# EAGLE schematic Automatic Pet Feeder (EAGLE 9.6.2)

## Sheet 1 of 3
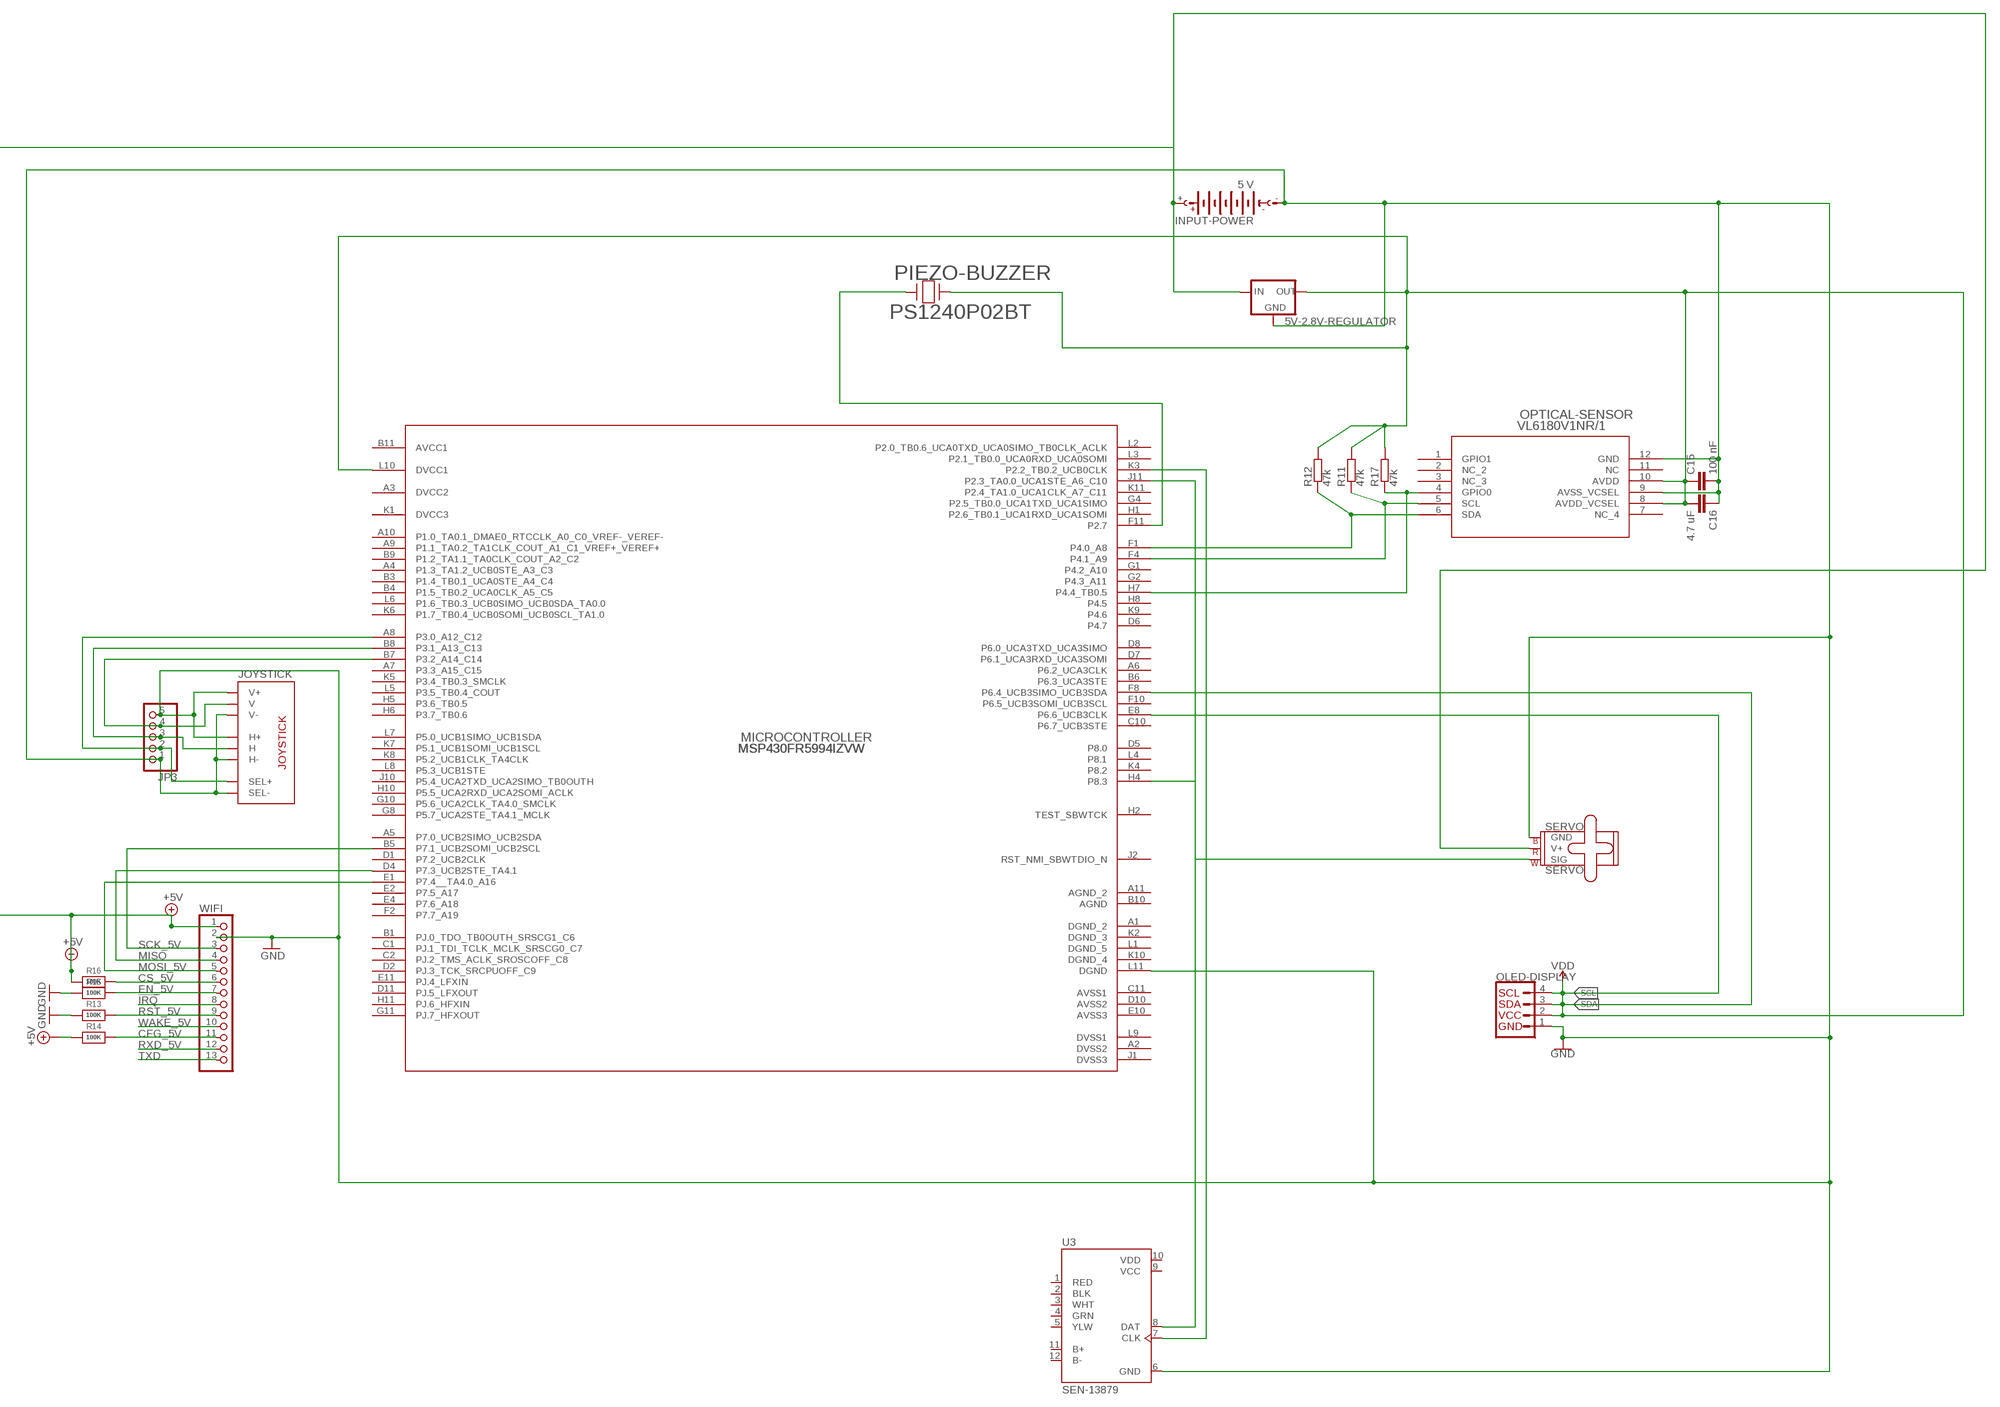
[diagram p0: schematic, sheet 1]

### Parts
5V-2.8V-REGULATOR  78XXS  [78XXS]
C15  100 nF  C2.5/2  [C2.5-2]
C16  4.7 uF  C2.5/2  [C2.5-2]
INPUT-POWER  5 V  AB9V  [AB9V]
JOYSTICK  JOYSTICKPTH  [JOYSTICK]
JP3  PINHD-1X5  [1X05]
MICROCONTROLLER  MSP430FR5994IZVW  [ZVW0087A]
OLED-DISPLAY  I2C_STANDARD_NO_SILK  [1X04_NO_SILK]
OPTICAL-SENSOR  VL6180V1NR/1  [VL6180X_STM]
PIEZO-BUZZER  PS1240P02BT  [XTAL_PS1240P02BT_TDK]
R11  47k  PMD  [PMD]
R12  47k  PMD  [PMD]
R13  100K  RESISTOR0805_NOOUTLINE  [0805-NO]
R14  100K  RESISTOR0805_NOOUTLINE  [0805-NO]
R15  100K  RESISTOR_0805MP  [_0805MP]
R16  100K  RESISTOR_0805MP  [_0805MP]
R17  47k  PMD  [PMD]
SERVO  SERVO  [1X03]
U3  SEN-13879  [SPARKFUN_SEN-13879]
WIFI  HEADER-1X13  [1X13_ROUND_70]

### Nets
!IRQ: WIFI.8
+5V: 5V-2.8V-REGULATOR.IN INPUT-POWER.+ R14.1 R16.1 WIFI.1
CFG_5V: R14.2 WIFI.11
CS_5V: R16.2 WIFI.6
EN_5V: R15.2 WIFI.7
GND: 5V-2.8V-REGULATOR.GND C15.2 C16.1 INPUT-POWER.- JOYSTICK.B2A(SEL-) JOYSTICK.H1(H+) JOYSTICK.H3(H-) JOYSTICK.V1(V+) JOYSTICK.V3(V-) JP3.1 JP3.5 MICROCONTROLLER.L11(DGND) OLED-DISPLAY.1(GND) OPTICAL-SENSOR.9(AVSS_VCSEL) OPTICAL-SENSOR.12(GND) R13.1 R15.1 SERVO.3(GND) U3.6(GND) WIFI.2
MISO: MICROCONTROLLER.D4(P7.3_UCB2STE_TA4.1) WIFI.4
MOSI_5V: MICROCONTROLLER.E1(P7.4__TA4.0_A16) WIFI.5
N$13: MICROCONTROLLER.H4(P8.3) SERVO.1(SIG)
N$14: MICROCONTROLLER.K3(P2.2_TB0.2_UCB0CLK) U3.7(CLK)
N$15: JOYSTICK.V2(V) JP3.4 MICROCONTROLLER.B7(P3.2_A14_C14)
N$16: JOYSTICK.H2(H) JP3.3 MICROCONTROLLER.B8(P3.1_A13_C13)
N$17: JOYSTICK.B1A(SEL+) JP3.2 MICROCONTROLLER.A8(P3.0_A12_C12)
N$18: MICROCONTROLLER.F11(P2.7) PIEZO-BUZZER.1
N$19: MICROCONTROLLER.J11(P2.3_TA0.0_UCA1STE_A6_C10) U3.8(DAT)
N$26: MICROCONTROLLER.H7(P4.4_TB0.5) OPTICAL-SENSOR.4(GPIO0) R17.2
N$27: MICROCONTROLLER.F4(P4.1_A9) OPTICAL-SENSOR.5(SCL) R11.2
N$28: MICROCONTROLLER.F1(P4.0_A8) OPTICAL-SENSOR.6(SDA) R12.2
N$29: SERVO.2(V+)
RST_5V: R13.2 WIFI.9
RXD_5V: WIFI.12
SCK_5V: MICROCONTROLLER.B5(P7.1_UCB2SOMI_UCB2SCL) WIFI.3
SCL: OLED-DISPLAY.4(SCL)
SDA: OLED-DISPLAY.3(SDA)
TXD: WIFI.13
VDD: 5V-2.8V-REGULATOR.OUT C15.1 C16.2 MICROCONTROLLER.E8(P6.6_UCB3CLK) MICROCONTROLLER.F8(P6.4_UCB3SIMO_UCB3SDA) MICROCONTROLLER.L10(DVCC1) OLED-DISPLAY.2(VCC) OPTICAL-SENSOR.8(AVDD_VCSEL) OPTICAL-SENSOR.10(AVDD) PIEZO-BUZZER.2 R11.1 R12.1 R17.1
WAKE_5V: WIFI.10
Unconnected: MICROCONTROLLER.A4(P1.3_TA1.2_UCB0STE_A3_C3) MICROCONTROLLER.A5(P7.0_UCB2SIMO_UCB2SDA) MICROCONTROLLER.A6(P6.2_UCA3CLK) MICROCONTROLLER.A7(P3.3_A15_C15) MICROCONTROLLER.A9(P1.1_TA0.2_TA1CLK_COUT_A1_C1_VREF+_VEREF+) MICROCONTROLLER.A10(P1.0_TA0.1_DMAE0_RTCCLK_A0_C0_VREF-_VEREF-) MICROCONTROLLER.B1(PJ.0_TDO_TB0OUTH_SRSCG1_C6) MICROCONTROLLER.B3(P1.4_TB0.1_UCA0STE_A4_C4) MICROCONTROLLER.B4(P1.5_TB0.2_UCA0CLK_A5_C5) MICROCONTROLLER.B6(P6.3_UCA3STE) MICROCONTROLLER.B9(P1.2_TA1.1_TA0CLK_COUT_A2_C2) MICROCONTROLLER.C1(PJ.1_TDI_TCLK_MCLK_SRSCG0_C7) MICROCONTROLLER.C2(PJ.2_TMS_ACLK_SROSCOFF_C8) MICROCONTROLLER.C10(P6.7_UCB3STE) MICROCONTROLLER.D1(P7.2_UCB2CLK) MICROCONTROLLER.D2(PJ.3_TCK_SRCPUOFF_C9) MICROCONTROLLER.D5(P8.0) MICROCONTROLLER.D6(P4.7) MICROCONTROLLER.D7(P6.1_UCA3RXD_UCA3SOMI) MICROCONTROLLER.D8(P6.0_UCA3TXD_UCA3SIMO) MICROCONTROLLER.D11(PJ.5_LFXOUT) MICROCONTROLLER.E2(P7.5_A17) MICROCONTROLLER.E4(P7.6_A18) MICROCONTROLLER.E11(PJ.4_LFXIN) MICROCONTROLLER.F2(P7.7_A19) MICROCONTROLLER.F10(P6.5_UCB3SOMI_UCB3SCL) MICROCONTROLLER.G1(P4.2_A10) MICROCONTROLLER.G2(P4.3_A11) MICROCONTROLLER.G4(P2.5_TB0.0_UCA1TXD_UCA1SIMO) MICROCONTROLLER.G8(P5.7_UCA2STE_TA4.1_MCLK) MICROCONTROLLER.G10(P5.6_UCA2CLK_TA4.0_SMCLK) MICROCONTROLLER.G11(PJ.7_HFXOUT) MICROCONTROLLER.H1(P2.6_TB0.1_UCA1RXD_UCA1SOMI) MICROCONTROLLER.H2(TEST_SBWTCK) MICROCONTROLLER.H5(P3.6_TB0.5) MICROCONTROLLER.H6(P3.7_TB0.6) MICROCONTROLLER.H8(P4.5) MICROCONTROLLER.H10(P5.5_UCA2RXD_UCA2SOMI_ACLK) MICROCONTROLLER.H11(PJ.6_HFXIN) MICROCONTROLLER.J2(RST_NMI_SBWTDIO_N) MICROCONTROLLER.J10(P5.4_UCA2TXD_UCA2SIMO_TB0OUTH) MICROCONTROLLER.K4(P8.2) MICROCONTROLLER.K5(P3.4_TB0.3_SMCLK) MICROCONTROLLER.K6(P1.7_TB0.4_UCB0SOMI_UCB0SCL_TA1.0) MICROCONTROLLER.K7(P5.1_UCB1SOMI_UCB1SCL) MICROCONTROLLER.K8(P5.2_UCB1CLK_TA4CLK) MICROCONTROLLER.K9(P4.6) MICROCONTROLLER.K11(P2.4_TA1.0_UCA1CLK_A7_C11) MICROCONTROLLER.L2(P2.0_TB0.6_UCA0TXD_UCA0SIMO_TB0CLK_ACLK) MICROCONTROLLER.L3(P2.1_TB0.0_UCA0RXD_UCA0SOMI) MICROCONTROLLER.L4(P8.1) MICROCONTROLLER.L5(P3.5_TB0.4_COUT) MICROCONTROLLER.L6(P1.6_TB0.3_UCB0SIMO_UCB0SDA_TA0.0) MICROCONTROLLER.L7(P5.0_UCB1SIMO_UCB1SDA) MICROCONTROLLER.L8(P5.3_UCB1STE) OPTICAL-SENSOR.1(GPIO1) OPTICAL-SENSOR.2(NC_2) OPTICAL-SENSOR.3(NC_3) OPTICAL-SENSOR.7(NC_4) OPTICAL-SENSOR.11(NC) U3.1(RED) U3.2(BLK) U3.3(WHT) U3.4(GRN) U3.5(YLW) U3.11(B+) U3.12(B-)

## Sheet 2 of 3

## Sheet 3 of 3

## Power pins joined to a net without a drawn wire
AGND: MICROCONTROLLER.B10(AGND)
AGND_2: MICROCONTROLLER.A11(AGND_2)
AVCC1: MICROCONTROLLER.B11(AVCC1)
AVSS1: MICROCONTROLLER.C11(AVSS1)
AVSS2: MICROCONTROLLER.D10(AVSS2)
AVSS3: MICROCONTROLLER.E10(AVSS3)
DGND_2: MICROCONTROLLER.A1(DGND_2)
DGND_3: MICROCONTROLLER.K2(DGND_3)
DGND_4: MICROCONTROLLER.K10(DGND_4)
DGND_5: MICROCONTROLLER.L1(DGND_5)
DVCC2: MICROCONTROLLER.A3(DVCC2)
DVCC3: MICROCONTROLLER.K1(DVCC3)
DVSS1: MICROCONTROLLER.L9(DVSS1)
DVSS2: MICROCONTROLLER.A2(DVSS2)
DVSS3: MICROCONTROLLER.J1(DVSS3)
VCC: U3.9(VCC)
VDD: U3.10(VDD)

## Library data of the parts
5V-2.8V-REGULATOR = v-reg:78XXS: VOLTAGE REGULATOR
C15 C16 = capacitor-wima:C: CAPACITOR naming: grid - package width
INPUT-POWER = battery:AB9V: 9-V BATTERY CLIP
JOYSTICK = adafruit:JOYSTICK: Thumb Joystick Joystick commonly found in PS2 controllers. Two pots and a select switch. Adapted from Sparkfun Library (but for more common 6mm switch sticks)
JP3 = pinhead:PINHD-1X5: PIN HEADER
MICROCONTROLLER = library:MSP430FR5994IZVW; COPYRIGHT: Copyright (C) 2025 Ultra Librarian. All rights reserved.; MANUFACTURER_PART_NUMBER: MSP430FR5994IZVW; MFR_NAME: Texas Instruments; REFDES: RefDes; TYPE: TYPE
OLED-DISPLAY = SparkX:I2C_STANDARD: SparkFun I2C Standard Pinout Header SparkFun has standardized on a pinout for all I2C based sensor breakouts. This pinout allows I2C boards to be plugged directly into the headers on Arduino Uno compatible boards, and to be daisy chained easily. Example SparkFun Products: SparkFun Atmospheric Sensor Breakout - BME280 <https://www.sparkfun.com/products/13676> SparkFun Altitude/Pressure Sensor Breakout - MPL3115A2 <https://www.sparkfun.com/products/11084> SparkFun TOF Range Finder Sensor - VL6180 <https://www.sparkfun.com/products/12785>
OPTICAL-SENSOR = library:VL6180V1NR/1; COPYRIGHT: Copyright (C) 2025 Ultra Librarian. All rights reserved.; MANUFACTURER_PART_NUMBER: VL6180V1NR/1; MFR_NAME: STMicroelectronics
PIEZO-BUZZER = library:PS1240P02BT; COPYRIGHT: Copyright (C) 2025 Ultra Librarian. All rights reserved.; MANUFACTURER_PART_NUMBER: PS1240P02BT; MFR_NAME: TDK
R11 R12 R17 = resistor-shunt:PMD: SMD SHUNT RESISTOR; OC_FARNELL: unknown; OC_NEWARK: unknown
R13-R16 = microbuilder:RESISTOR: Resistors For new designs, use the packages preceded by an '_' character since they are more reliable: The following footprints should be used on most boards: _0402 - Standard footprint for regular board layouts _0603 - Standard footprint for regular board layouts _0805 - Standard footprint for regular board layouts _1206 - Standard footprint for regular board layouts For extremely tight-pitch boards where space is at a premium, the following 'micro-pitch' footprints can be used (smaller pads, no silkscreen outline, etc.): _0402MP - Micro-pitch footprint for very dense/compact boards _0603MP - Micro-pitch footprint for very dense/compact boards _0805MP - Micro-pitch footprint for very dense/compact boards _1206MP - Micro-pitch footprint for very dense/compact boards
SERVO = SparkFun-Electromechanical:SERVO: Servo Motor 3-pin connector for a standard servo motor (voltage supply, ground, and control signal.) SparkFun Products Servo - Generic (Sub-Micro Size) <https://www.sparkfun.com/products/9065> (ROB-09065) Servo - Generic High Torque Continuous Rotation (Standard Size) <https://www.sparkfun.com/products/9347> (ROB-09347) Servo - Generic High Torque (Standard Size) <https://www.sparkfun.com/products/11965> (ROB-11965)
U3 = SEN-13879:SEN-13879; MANUFACTURER: SparkFun; STANDARD: Manufacturer Recommendations
WIFI = microbuilder:HEADER-1X13